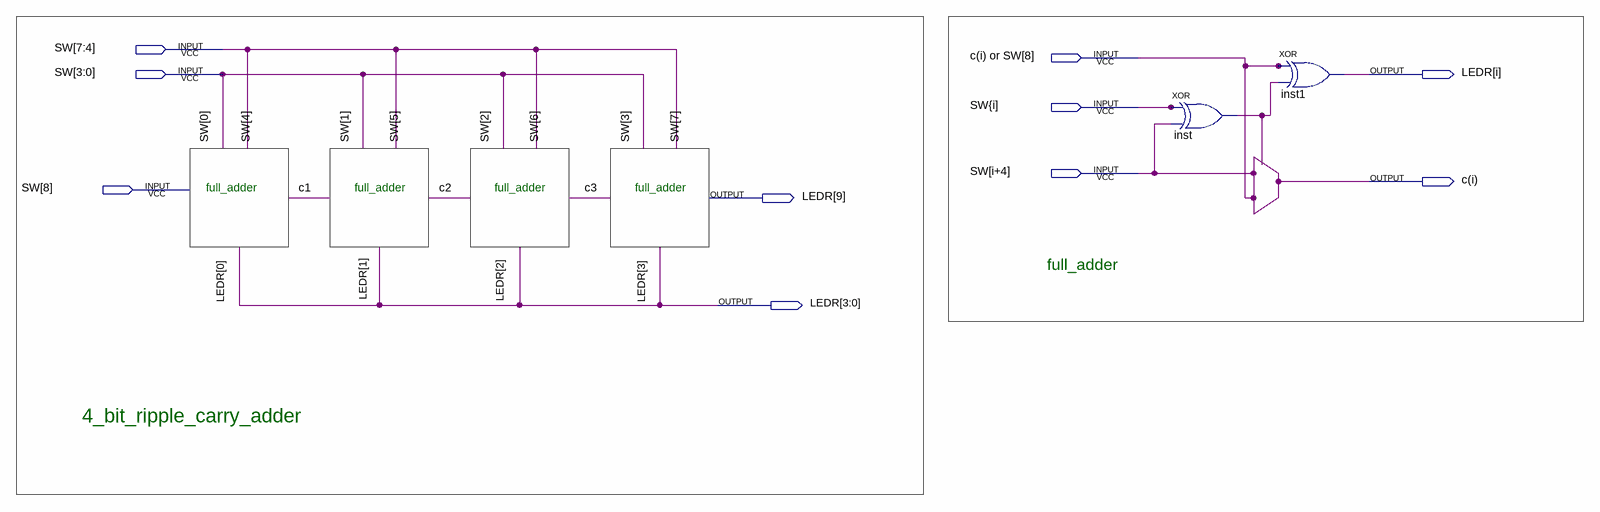
[diagram p0: schematic sheet]
// Quartus schematic 4-bitRippleCarryAdder.bdf as structural Verilog: 2 symbols, 10 pins
module \4-bitRippleCarryAdder  (
  input  [8:0] SW,
  input  [8:8] \c(i)_or_SW ,
  input  \SW{i] ,
  input  \SW[i+4] ,
  output \LEDR[i] ,
  output \c(i) ,
  output [9:0] LEDR
);

  wire inst_out;

  xor inst (inst_out, \SW{i] , \c(i)_or_SW [8]);
  xor inst1 (\LEDR[i] , \c(i)_or_SW [8], inst_out);

  assign \c(i)  = \c(i)_or_SW [8];
  assign LEDR[2:0] = {3{LEDR[3]}};
  assign {SW[6:4], SW[2:0]} = {{3{SW[7]}}, {3{SW[3]}}};
  assign \SW[i+4]  = \c(i)_or_SW [8];

  // Notes on the sheet:
  //   full_adder
  //   full_adder
  //   full_adder
  //   full_adder
  //   full_adder
  //   4_bit_ripple_carry_adder
endmodule
